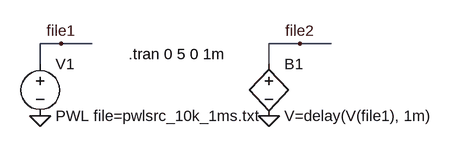
[diagram p0: schematic Draft2.asc]
Draft2.asc, the LTspice schematic file:
Version 4
SHEET 1 880 680
WIRE 0 96 -32 96
WIRE 48 96 0 96
WIRE 368 96 320 96
WIRE 416 96 368 96
WIRE -32 128 -32 96
WIRE 320 128 320 96
FLAG -32 208 0
FLAG 320 208 0
FLAG 0 96 file1
FLAG 368 96 file2
SYMBOL voltage -32 112 R0
WINDOW 123 0 0 Left 2
WINDOW 39 0 0 Left 2
SYMATTR InstName V1
SYMATTR Value PWL file=pwlsrc_10k_1ms.txt
SYMBOL bv 320 112 R0
SYMATTR InstName B1
SYMATTR Value V=delay(V(file1), 1m)
TEXT 104 112 Left 2 !.tran 0 5 0 1m

The netlist it stands for:
* Draft2.asc
V1 file1 0 PWL file=pwlsrc_10k_1ms.txt
B1 file2 0 V=delay(V(file1), 1m)
.tran 0 5 0 1m
.backanno
.end